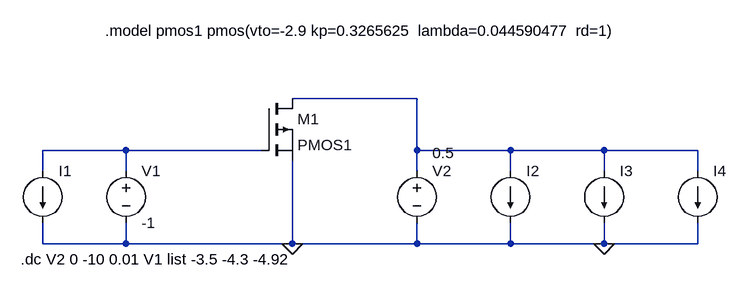
[diagram p0: schematic Exp.asc]
Exp.asc, the LTspice schematic file:
Version 4
SHEET 1 161040 680
WIRE 416 64 224 64
WIRE -32 144 -160 144
WIRE 176 144 -32 144
WIRE 416 144 416 64
WIRE 560 144 416 144
WIRE 704 144 560 144
WIRE 848 144 704 144
WIRE -160 176 -160 144
WIRE -32 176 -32 144
WIRE 416 176 416 144
WIRE 560 176 560 144
WIRE 704 176 704 144
WIRE 848 176 848 144
WIRE -160 288 -160 256
WIRE -32 288 -32 256
WIRE -32 288 -160 288
WIRE 224 288 224 160
WIRE 224 288 -32 288
WIRE 416 288 416 256
WIRE 416 288 224 288
WIRE 560 288 560 256
WIRE 560 288 416 288
WIRE 704 288 704 256
WIRE 704 288 560 288
WIRE 848 288 848 256
WIRE 848 288 704 288
FLAG 224 288 0
FLAG 704 288 0
SYMBOL voltage -32 160 R0
WINDOW 123 0 0 Left 0
WINDOW 39 0 0 Left 0
SYMATTR InstName V1
SYMATTR Value -1
SYMBOL pmos 176 64 R0
SYMATTR InstName M1
SYMATTR Value PMOS1
SYMBOL voltage 416 160 R0
WINDOW 3 24 -12 Left 2
WINDOW 123 0 0 Left 0
WINDOW 39 0 0 Left 0
SYMATTR InstName V2
SYMATTR Value 0.5
SYMBOL current -160 176 R0
WINDOW 3 24 28 Invisible 2
WINDOW 123 0 0 Left 0
WINDOW 39 0 0 Left 0
SYMATTR InstName I1
SYMATTR Value TBL(-6.2 -0.0136 -4.8 -0.0132 -4.3 -0.0127 -4.1 -0.0122 -3.9 -0.0116 -3.8 -0.0114 -3.7 -0.0104 -3.6 -0.01 -3.5 -0.0086 -3.42 -0.0074 -3.36 -0.0065 -3.2 -0.0024 -3 0 -2.6 0.0007)
SYMBOL current 704 176 R0
WINDOW 3 24 28 Invisible 2
WINDOW 123 0 0 Left 0
WINDOW 39 0 0 Left 0
SYMATTR InstName I3
SYMATTR Value TBL(-10.18 -0.409 -9.9 -0.407 -9 -0.394 -7.58 -0.382 -4.48 -0.348 -3.02 -0.326 -1.86 -0.305 -1.5 -0.298 -0.78 -0.259 -0.47 -0.223 -0.43 -0.214 -0.31 -0.18 -0.25 -0.147 -0.14 -0.092 -0.08 -0.057 -0.06 -0.042 -0.01 -0.0048)
SYMBOL current 560 176 R0
WINDOW 3 24 28 Invisible 2
WINDOW 123 0 0 Left 0
WINDOW 39 0 0 Left 0
SYMATTR InstName I2
SYMATTR Value TBL(-10.4 -0.063 -9 -0.06 -8.2 -0.057 -7.7 -0.0553 -4.7 -0.0498 -3.5 -0.0478 -3.1 -0.0469 -2.2 -0.0451 -2 -0.0444 -1.7 -0.0432 -0.8 -0.039 -0.5 -0.037 -0.4 -0.036 -0.2 -0.0307 -0.1 -0.005 -0.02 -0.0189)
SYMBOL current 848 176 R0
WINDOW 3 24 28 Invisible 2
WINDOW 123 0 0 Left 0
WINDOW 39 0 0 Left 0
SYMATTR InstName I4
SYMATTR Value TBL(-7.9 -0.814 -6.5 -0.787 -5.15 -0.759 -3.63 -0.719 -1.6 -0.636 -0.77 -0.53 -0.57 -0.455 -0.42 -0.372 -0.34 -0.312 -0.25 -0.238 -0.2 -0.197 -0.16 -0.16 -0.09 -0.0931 -0.08 -0.0823 -0.07 -0.0723 -0.06 -0.0606 -0.05 -0.0585 -0.04 -0.0424 0 -0.0057)
TEXT -64 -40 Left 2 !.model pmos1 pmos(vto=-2.9 kp=0.3265625  lambda=0.044590477  rd=1)
TEXT -194 312 Left 2 !.dc V2 0 -10 0.01 V1 list -3.5 -4.3 -4.92

The netlist it stands for:
* Exp.asc
V1 N002 0 -1
M1 N001 N002 0 0 PMOS1
V2 N001 0 0.5
I1 N002 0 TBL(-6.2 -0.0136 -4.8 -0.0132 -4.3 -0.0127 -4.1 -0.0122 -3.9 -0.0116 -3.8 -0.0114 -3.7 -0.0104 -3.6 -0.01 -3.5 -0.0086 -3.42 -0.0074 -3.36 -0.0065 -3.2 -0.0024 -3 0 -2.6 0.0007)
I3 N001 0 TBL(-10.18 -0.409 -9.9 -0.407 -9 -0.394 -7.58 -0.382 -4.48 -0.348 -3.02 -0.326 -1.86 -0.305 -1.5 -0.298 -0.78 -0.259 -0.47 -0.223 -0.43 -0.214 -0.31 -0.18 -0.25 -0.147 -0.14 -0.092 -0.08 -0.057 -0.06 -0.042 -0.01 -0.0048)
I2 N001 0 TBL(-10.4 -0.063 -9 -0.06 -8.2 -0.057 -7.7 -0.0553 -4.7 -0.0498 -3.5 -0.0478 -3.1 -0.0469 -2.2 -0.0451 -2 -0.0444 -1.7 -0.0432 -0.8 -0.039 -0.5 -0.037 -0.4 -0.036 -0.2 -0.0307 -0.1 -0.005 -0.02 -0.0189)
I4 N001 0 TBL(-7.9 -0.814 -6.5 -0.787 -5.15 -0.759 -3.63 -0.719 -1.6 -0.636 -0.77 -0.53 -0.57 -0.455 -0.42 -0.372 -0.34 -0.312 -0.25 -0.238 -0.2 -0.197 -0.16 -0.16 -0.09 -0.0931 -0.08 -0.0823 -0.07 -0.0723 -0.06 -0.0606 -0.05 -0.0585 -0.04 -0.0424 0 -0.0057)
.model NMOS NMOS
.model PMOS PMOS
.lib standard.mos
.model pmos1 pmos(vto=-2.9 kp=0.3265625  lambda=0.044590477  rd=1)
.dc V2 0 -10 0.01 V1 list -3.5 -4.3 -4.92
.backanno
.end